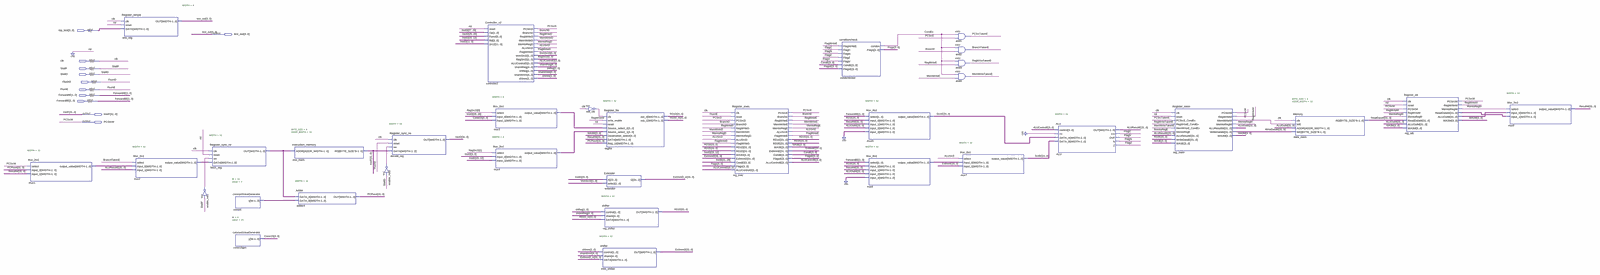
[diagram p0: schematic sheet, whole]
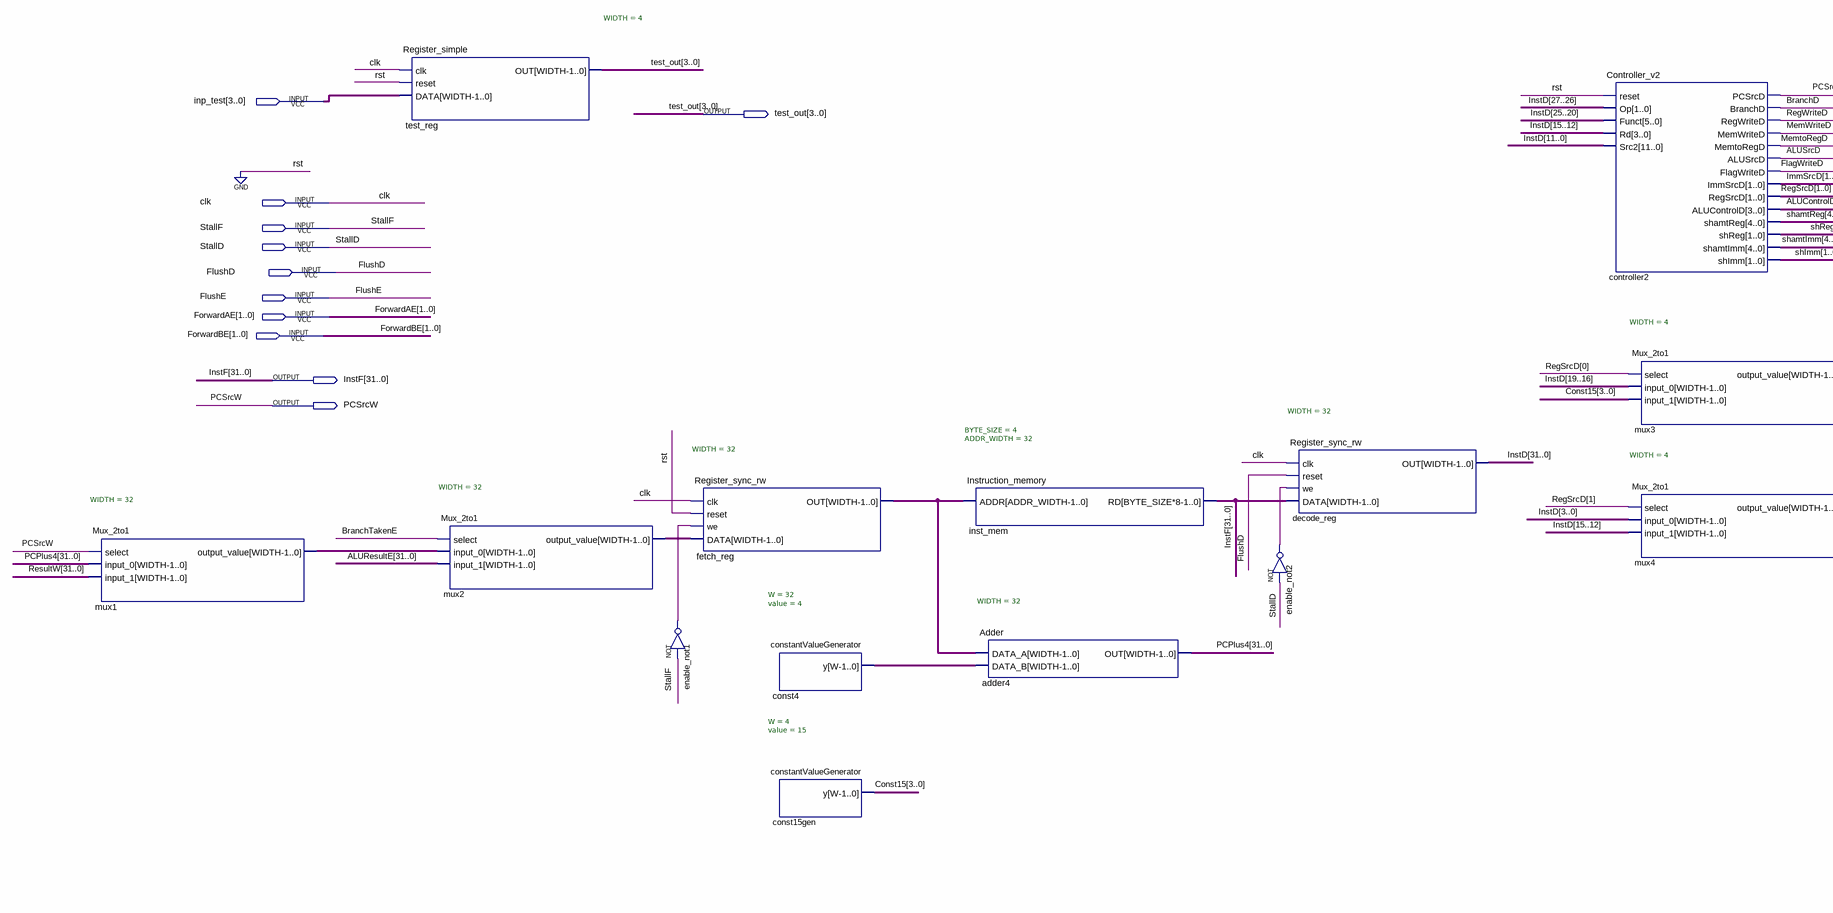
[diagram p1: schematic sheet, left part]
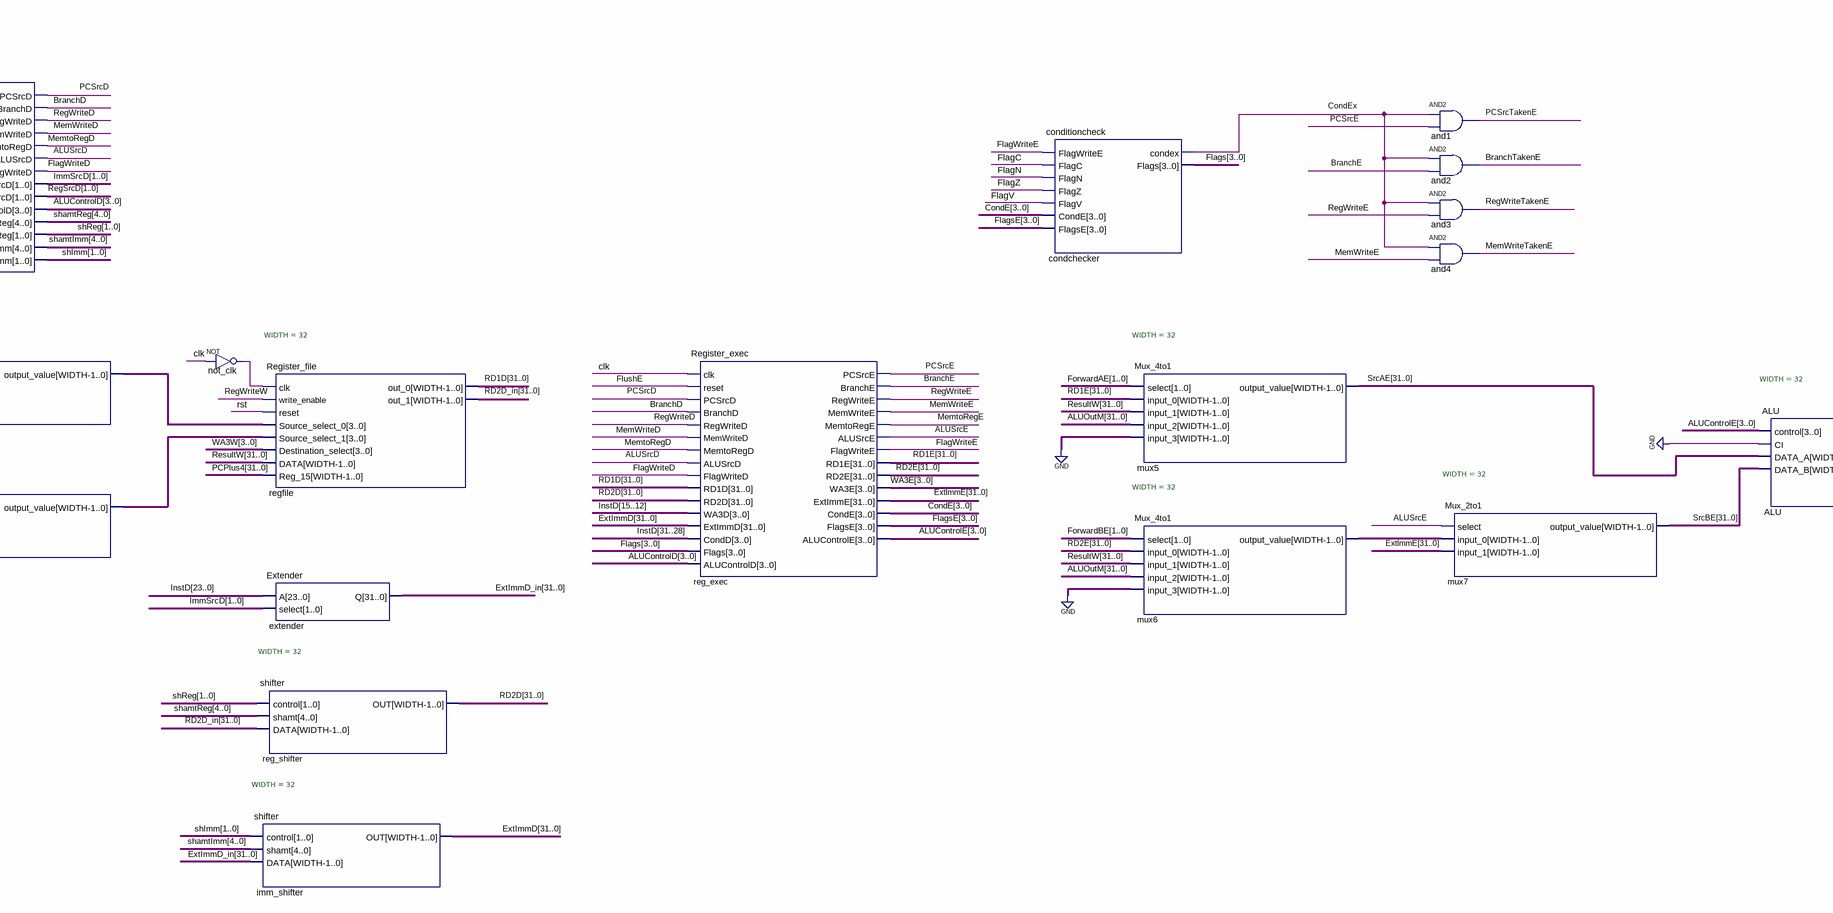
[diagram p2: schematic sheet, centre part]
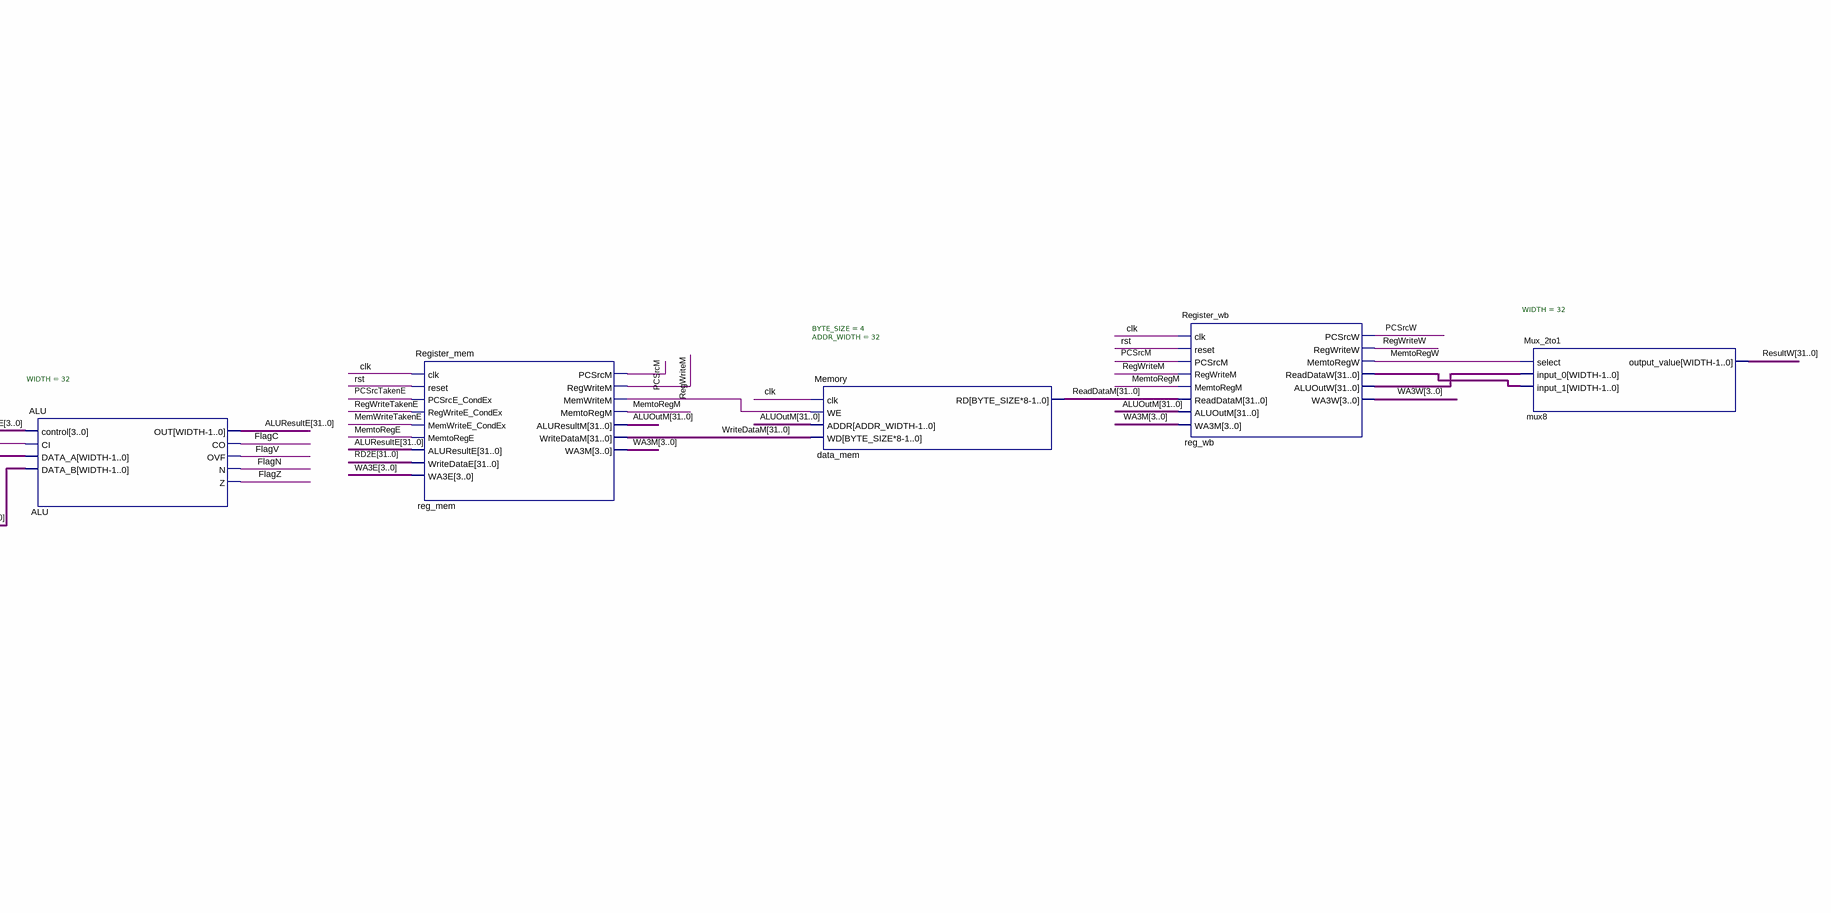
[diagram p3: schematic sheet, right part]
// Quartus schematic eru446.bdf as structural Verilog: 33 symbols, 11 pins
module eru446 (
  input  [3:0] inp_test,
  input  clk,
  input  StallF,
  input  StallD,
  input  FlushD,
  input  FlushE,
  input  [1:0] ForwardAE,
  input  [1:0] ForwardBE,
  output [3:0] test_out,
  output [31:0] InstF,
  output PCSrcW
);

  wire ALUSrcD, ALUSrcE, BranchD, BranchE, BranchTakenE, CondEx, enable_not1_out, enable_not2_out, FlagC,
       FlagN, FlagV, FlagWriteD, FlagWriteE, FlagZ, MemtoRegD, MemtoRegE, MemtoRegM, MemtoRegW, MemWriteD,
       MemWriteE, MemWriteTakenE, not_clk_out, PCSrcD, PCSrcE, PCSrcM, PCSrcTakenE, reg_mem_memwritem,
       RegWriteD, RegWriteE, RegWriteM, RegWriteTakenE, RegWriteW;
  wire [1:0] ImmSrcD, RegSrcD, shImm, shReg;
  wire [3:0] ALUControlD, ALUControlE, CondE, Const15, Flags, FlagsE, mux3_output_value, mux4_output_value,
       WA3E, WA3M, WA3W;
  wire [4:0] shamtImm, shamtReg;
  wire [31:0] ALUOutM, ALUResultE, const4_y, ExtImmD, ExtImmD_in, ExtImmE, fetch_reg_out, InstD,
       mux1_output_value, mux2_output_value, mux6_output_value, PCPlus4, RD1D, RD1E, RD2D, RD2D_in, RD2E,
       ReadDataM, reg_wb_aluoutw, reg_wb_readdataw, ResultW, SrcAE, SrcBE, WriteDataM;

  Mux_2to1 #(.WIDTH(32)) mux1 (.select(PCSrcW), .input_0(PCPlus4), .input_1(ResultW), .output_value(mux1_output_value));
  Register_simple #(.WIDTH(4)) test_reg (.clk(clk), .reset(1'b0), .DATA(inp_test), .OUT(test_out));
  Mux_2to1 #(.WIDTH(32)) mux2 (
    .select(BranchTakenE), .input_0(mux1_output_value), .input_1(ALUResultE), .output_value(mux2_output_value));
  Register_sync_rw #(.WIDTH(32)) fetch_reg (
    .clk(clk), .reset(1'b0), .we(enable_not1_out), .DATA(mux2_output_value), .OUT(fetch_reg_out));
  not enable_not1 (enable_not1_out, StallF);
  constantValueGenerator #(.W(32), .value(4)) const4 (.y(const4_y));
  constantValueGenerator #(.W(4), .value(15)) const15gen (.y(Const15));
  Instruction_memory #(.BYTE_SIZE(4), .ADDR_WIDTH(32)) inst_mem (.ADDR(fetch_reg_out), .RD(InstF));
  Adder #(.WIDTH(32)) adder4 (.DATA_A(fetch_reg_out), .DATA_B(const4_y), .OUT(PCPlus4));
  Register_sync_rw #(.WIDTH(32)) decode_reg (
    .clk(clk), .reset(FlushD), .we(enable_not2_out), .DATA(InstF), .OUT(InstD));
  not enable_not2 (enable_not2_out, StallD);
  Controller_v2 controller2 (
    .reset(1'b0), .Op(InstD[27:26]), .Funct(InstD[25:20]), .Rd(InstD[15:12]), .Src2(InstD[11:0]),
    .PCSrcD(PCSrcD), .BranchD(BranchD), .RegWriteD(RegWriteD), .MemWriteD(MemWriteD), .MemtoRegD(MemtoRegD),
    .ALUSrcD(ALUSrcD), .FlagWriteD(FlagWriteD), .ImmSrcD(ImmSrcD), .RegSrcD(RegSrcD),
    .ALUControlD(ALUControlD), .shamtReg(shamtReg), .shReg(shReg), .shamtImm(shamtImm), .shImm(shImm));
  Mux_2to1 #(.WIDTH(4)) mux3 (
    .select(RegSrcD[0]), .input_0(InstD[19:16]), .input_1(Const15), .output_value(mux3_output_value));
  Mux_2to1 #(.WIDTH(4)) mux4 (
    .select(RegSrcD[1]), .input_0(InstD[3:0]), .input_1(InstD[15:12]), .output_value(mux4_output_value));
  not not_clk (not_clk_out, clk);
  Register_file #(.WIDTH(32)) regfile (
    .clk(not_clk_out), .write_enable(RegWriteW), .reset(1'b0), .Source_select_0(mux3_output_value),
    .Source_select_1(mux4_output_value), .Destination_select(WA3W), .DATA(ResultW), .Reg_15(PCPlus4),
    .out_0(RD1D), .out_1(RD2D_in));
  Extender extender (.A(InstD[23:0]), .select(ImmSrcD), .Q(ExtImmD_in));
  shifter #(.WIDTH(32)) reg_shifter (.control(shReg), .shamt(shamtReg), .DATA(RD2D_in), .OUT(RD2D));
  shifter #(.WIDTH(32)) imm_shifter (.control(shImm), .shamt(shamtImm), .DATA(ExtImmD_in), .OUT(ExtImmD));
  Register_exec reg_exec (
    .clk(clk), .reset(FlushE), .PCSrcD(PCSrcD), .BranchD(BranchD), .RegWriteD(RegWriteD),
    .MemWriteD(MemWriteD), .MemtoRegD(MemtoRegD), .ALUSrcD(ALUSrcD), .FlagWriteD(FlagWriteD), .RD1D(RD1D),
    .RD2D(RD2D), .WA3D(InstD[15:12]), .ExtImmD(ExtImmD), .CondD(InstD[31:28]), .Flags(Flags),
    .ALUControlD(ALUControlD), .PCSrcE(PCSrcE), .BranchE(BranchE), .RegWriteE(RegWriteE),
    .MemWriteE(MemWriteE), .MemtoRegE(MemtoRegE), .ALUSrcE(ALUSrcE), .FlagWriteE(FlagWriteE), .RD1E(RD1E),
    .RD2E(RD2E), .WA3E(WA3E), .ExtImmE(ExtImmE), .CondE(CondE), .FlagsE(FlagsE), .ALUControlE(ALUControlE));
  conditioncheck condchecker (
    .FlagWriteE(FlagWriteE), .FlagC(FlagC), .FlagN(FlagN), .FlagZ(FlagZ), .FlagV(FlagV), .CondE(CondE),
    .FlagsE(FlagsE), .condex(CondEx), .Flags(Flags));
  Mux_4to1 #(.WIDTH(32)) mux5 (
    .select(ForwardAE), .input_0(RD1E), .input_1(ResultW), .input_2(ALUOutM), .input_3({32{1'b0}}),
    .output_value(SrcAE));
  Mux_4to1 #(.WIDTH(32)) mux6 (
    .select(ForwardBE), .input_0(RD2E), .input_1(ResultW), .input_2(ALUOutM), .input_3({32{1'b0}}),
    .output_value(mux6_output_value));
  and and1 (PCSrcTakenE, CondEx, PCSrcE);
  and and2 (BranchTakenE, CondEx, BranchE);
  and and3 (RegWriteTakenE, CondEx, RegWriteE);
  and and4 (MemWriteTakenE, CondEx, MemWriteE);
  Mux_2to1 #(.WIDTH(32)) mux7 (.select(ALUSrcE), .input_0(mux6_output_value), .input_1(ExtImmE), .output_value(SrcBE));
  ALU #(.WIDTH(32)) ALU (
    .control(ALUControlE), .CI(1'b0), .DATA_A(SrcAE), .DATA_B(SrcBE), .OUT(ALUResultE), .CO(FlagC),
    .OVF(FlagV), .N(FlagN), .Z(FlagZ));
  Register_mem reg_mem (
    .clk(clk), .reset(1'b0), .PCSrcE_CondEx(PCSrcTakenE), .RegWriteE_CondEx(RegWriteTakenE),
    .MemWriteE_CondEx(MemWriteTakenE), .MemtoRegE(MemtoRegE), .ALUResultE(ALUResultE), .WriteDataE(RD2E),
    .WA3E(WA3E), .PCSrcM(PCSrcM), .RegWriteM(RegWriteM), .MemWriteM(reg_mem_memwritem),
    .MemtoRegM(MemtoRegM), .ALUResultM(ALUOutM), .WriteDataM(WriteDataM), .WA3M(WA3M));
  Memory #(.BYTE_SIZE(4), .ADDR_WIDTH(32)) data_mem (
    .clk(clk), .WE(reg_mem_memwritem), .ADDR(ALUOutM), .WD(WriteDataM), .RD(ReadDataM));
  Register_wb reg_wb (
    .clk(clk), .reset(1'b0), .PCSrcM(PCSrcM), .RegWriteM(RegWriteM), .MemtoRegM(MemtoRegM),
    .ReadDataM(ReadDataM), .ALUOutM(ALUOutM), .WA3M(WA3M), .PCSrcW(PCSrcW), .RegWriteW(RegWriteW),
    .MemtoRegW(MemtoRegW), .ReadDataW(reg_wb_readdataw), .ALUOutW(reg_wb_aluoutw), .WA3W(WA3W));
  Mux_2to1 #(.WIDTH(32)) mux8 (
    .select(MemtoRegW), .input_0(reg_wb_aluoutw), .input_1(reg_wb_readdataw), .output_value(ResultW));
endmodule
